# EAGLE design placa_motor_v5 (EAGLE 9.5.1)
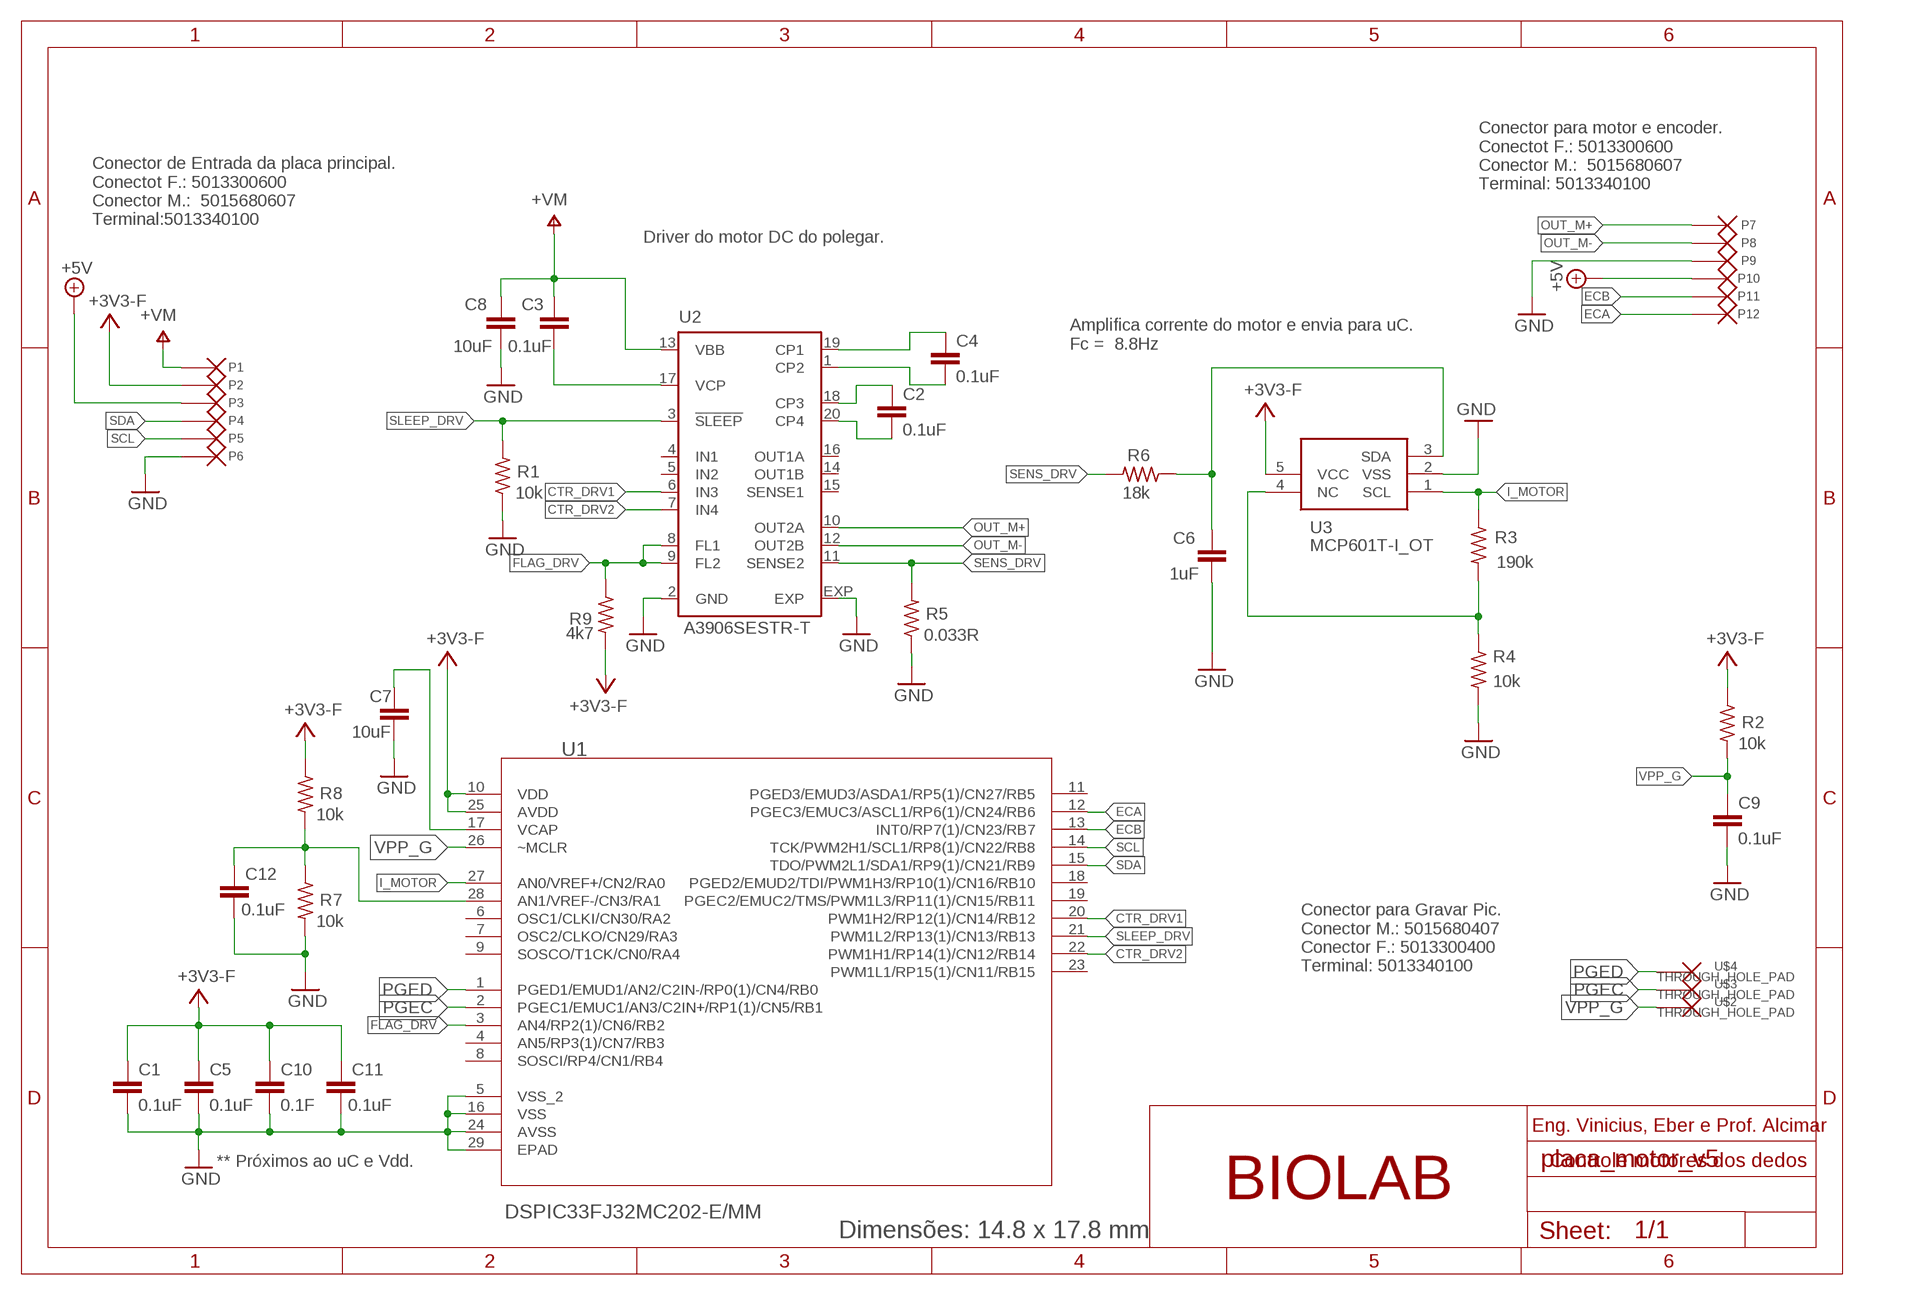
[diagram p0: schematic, sheet 1]

## Parts
C1  0.1uF  C-EUC0402K  [C0402K]
C2  0.1uF  C-EUC0402K  [C0402K]
C3  0.1uF  C-EUC0402K  [C0402K]
C4  0.1uF  C-EUC0402K  [C0402K]
C5  0.1uF  C-EUC0402K  [C0402K]
C6  1uF  C-EUC0402K  [C0402K]
C7  10uF  C-EUC0805K  [C0805K]
C8  10uF  C-EUC0805K  [C0805K]
C9  0.1uF  C-EUC0402K  [C0402K]
C10  0.1F  C-EUC0402K  [C0402K]
C11  0.1uF  C-EUC0402K  [C0402K]
C12  0.1uF  C-EUC0402K  [C0402K]
P1  THROUGH_HOLE_PAD  [THROUGH_HOLE_PAD]
P2  THROUGH_HOLE_PAD  [THROUGH_HOLE_PAD]
P3  THROUGH_HOLE_PAD  [THROUGH_HOLE_PAD]
P4  THROUGH_HOLE_PAD  [THROUGH_HOLE_PAD]
P5  THROUGH_HOLE_PAD  [THROUGH_HOLE_PAD]
P6  THROUGH_HOLE_PAD  [THROUGH_HOLE_PAD]
P7  THROUGH_HOLE_PAD  [THROUGH_HOLE_PAD]
P8  THROUGH_HOLE_PAD  [THROUGH_HOLE_PAD]
P9  THROUGH_HOLE_PAD  [THROUGH_HOLE_PAD]
P10  THROUGH_HOLE_PAD  [THROUGH_HOLE_PAD]
P11  THROUGH_HOLE_PAD  [THROUGH_HOLE_PAD]
P12  THROUGH_HOLE_PAD  [THROUGH_HOLE_PAD]
R1  10k  R-US_R0402  [R0402]
R2  10k  R-US_R0402  [R0402]
R3  190k  R-US_R0402  [R0402]
R4  10k  R-US_R0402  [R0402]
R5  0.033R  R-US_R0805  [R0805]
R6  18k  R-US_R0402  [R0402]
R7  10k  R-US_R0402  [R0402]
R8  10k  R-US_R0402  [R0402]
R9  4k7  R-US_R0402  [R0402]
U1  DSPIC33FJ32MC202-E/MM  [QFN65P600X600X100-29N]
U2  A3906SESTR-T  A3906  [QFN20]
U3  MCP601T-I_OT  [SOT95P270X145-5N]
U$2  THROUGH_HOLE_PAD  [THROUGH_HOLE_PAD]
U$3  THROUGH_HOLE_PAD  [THROUGH_HOLE_PAD]
U$4  THROUGH_HOLE_PAD  [THROUGH_HOLE_PAD]

## Nets
+3V3: C1.1 C5.1 C10.1 C11.1 P2.P$1(PIN) R2.1 R8.1 R9.2 U1.10(VDD) U1.25(AVDD) U3.5(VCC) ; supply symbol labelled +3V3-F
+5V: P3.P$1(PIN) P10.P$1(PIN)
AUX: C12.1 R7.1 R8.2 U1.28(AN1/VREF-/CN3/RA1)
CTR_DRV1: U1.20(PWM1H2/RP12(1)/CN14/RB12) U2.6(IN3)
CTR_DRV2: U1.22(PWM1H1/RP14(1)/CN12/RB14) U2.7(IN4)
ECA: P12.P$1(PIN) U1.12(PGEC3/EMUC3/ASCL1/RP6(1)/CN24/RB6)
ECB: P11.P$1(PIN) U1.13(INT0/RP7(1)/CN23/RB7)
FLAG_DRV: R9.1 U1.3(AN4/RP2(1)/CN6/RB2) U2.8(FL1) U2.9(FL2)
GND: C1.2 C5.2 C6.2 C7.2 C8.1 C9.2 C10.2 C11.2 C12.2 P6.P$1(PIN) P9.P$1(PIN) R1.1 R4.2 R5.1 R7.2 U1.5(VSS_2) U1.16(VSS) U1.24(AVSS) U1.29(EPAD) U2.2(GND) U2.EXP U3.2(VSS)
I_MOTOR: R3.1 U1.27(AN0/VREF+/CN2/RA0) U3.1(SCL)
N1: C7.1 U1.17(VCAP)
N2: R3.2 R4.1 U3.4(NC)
N3: C6.1 R6.1 U3.3(SDA)
N4: C4.1 U2.19(CP1)
N5: C4.2 U2.1(CP2)
N6: C2.1 U2.18(CP3)
N7: C2.2 U2.20(CP4)
N8: C3.2 U2.17(VCP)
OUT_M+: P7.P$1(PIN) U2.10(OUT2A)
OUT_M-: P8.P$1(PIN) U2.12(OUT2B)
PGEC: U1.2(PGEC1/EMUC1/AN3/C2IN+/RP1(1)/CN5/RB1) U$3.P$1(PIN)
PGED: U1.1(PGED1/EMUD1/AN2/C2IN-/RP0(1)/CN4/RB0) U$4.P$1(PIN)
SCL: P5.P$1(PIN) U1.14(TCK/PWM2H1/SCL1/RP8(1)/CN22/RB8)
SDA: P4.P$1(PIN) U1.15(TDO/PWM2L1/SDA1/RP9(1)/CN21/RB9)
SENS_DRV: R5.2 R6.2 U2.11(SENSE2)
SLEEP_DRV: R1.2 U1.21(PWM1L2/RP13(1)/CN13/RB13) U2.3(!SLEEP)
V+: C3.1 C8.2 P1.P$1(PIN) U2.13(VBB) ; supply symbol labelled +VM
VPP_G: C9.1 R2.2 U1.26(~MCLR) U$2.P$1(PIN)
Unconnected: U1.4(AN5/RP3(1)/CN7/RB3) U1.6(OSC1/CLKI/CN30/RA2) U1.7(OSC2/CLKO/CN29/RA3) U1.8(SOSCI/RP4/CN1/RB4) U1.9(SOSCO/T1CK/CN0/RA4) U1.11(PGED3/EMUD3/ASDA1/RP5(1)/CN27/RB5) U1.18(PGED2/EMUD2/TDI/PWM1H3/RP10(1)/CN16/RB10) U1.19(PGEC2/EMUC2/TMS/PWM1L3/RP11(1)/CN15/RB11) U1.23(PWM1L1/RP15(1)/CN11/RB15) U2.4(IN1) U2.5(IN2) U2.14(OUT1B) U2.15(SENSE1) U2.16(OUT1A)

## Notes on the sheet
- Conector para motor e encoder.
  Conectot F.: 5013300600
  Conector M.:  5015680607
  Terminal: 5013340100
- Conector de Entrada da placa principal.
  Conectot F.: 5013300600
  Conector M.:  5015680607
  Terminal:5013340100
- Driver do motor DC do polegar.
- Amplifica corrente do motor e envia para uC.
  Fc =  8.8Hz
- Conector para Gravar Pic.
  Conector M.: 5015680407
  Conector F.: 5013300400
  Terminal: 5013340100
- Eng. Vinicius, Eber e Prof. Alcimar
- ** Próximos ao uC e Vdd. | Controle motores dos dedos
- BIOLAB
- Dimensões: 14.8 x 17.8 mm

## Library data of the parts
C1-C12 = rcl:C-EU: CAPACITOR, European symbol
P1-P12 U$2-U$4 = THROUGH_HOLE_PAD:THROUGH_HOLE_PAD
R1-R9 = rcl:R-US_: RESISTOR, American symbol
U1 = DSPIC33FJ32MC202-E_MM:DSPIC33FJ32MC202-E/MM: 16-bit Digital Signal Controllers; DESCRIPTION: dsPIC Automotive, AEC-Q100, dsPIC™ 33F Microcontroller IC 16-Bit 40 MIPs 32KB _32K x 8_ FLASH 28-QFN-S _6x6_; DIGI-KEY_PART_NUMBER: DSPIC33FJ32MC202-E/MM-ND; DIGI-KEY_PURCHASE_URL: https://www.digikey.com/product-detail/en/microchip-technology/DSPIC33FJ32MC202-E-MM/DSPIC33FJ32MC202-E-MM-ND/1635835?utm_source=snapeda&utm_medium=aggregator&utm_campaign=symbol; MF: Microchip; MP: DSPIC33FJ32MC202-E/MM; PACKAGE: QFN-28 Microchip
U2 = allegro:A3906: Low Voltage Stepper and Single/Dual DC Motor Driver Data Sheet <http://www.allegromicro.com/en/Products/Part_Numbers/3906/3906.pdf>; SPICEPREFIX: X
U3 = MCP601T-I_OT:MCP601T-I_OT: 2.7 to 5.5V CMOS Operational Amplifier Source: Datasheet <http://ww1.microchip.com/downloads/en/DeviceDoc/21178H.pdf>; DESCRIPTION: 2.7 to 5.5V CMOS Operational Amplifier; HEIGHT: 1.45mm; MANUFACTURER_NAME: Microchip; MANUFACTURER_PART_NUMBER: MCP601T-I/OT; MOUSER_PART_NUMBER: 579-MCP601T-I/OT; MOUSER_PRICE-STOCK: https://www.mouser.co.uk/ProductDetail/Microchip-Technology/MCP601T-I-OT?qs=TQnwojwsYvgI5ywjvKCAVw%3D%3D

## Net classes
0 default: width 0.09 mm, drill 0.254 mm, clearance 0.05 mm
1 Power: width 0.15 mm, drill 0.254 mm, clearance 0.05 mm to class 0, clearance 0.05 mm

## Board
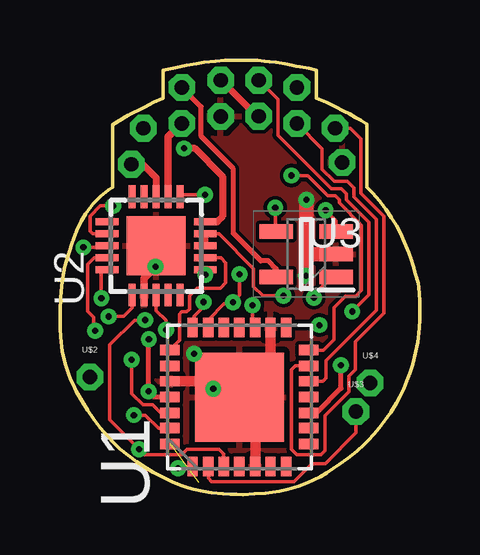
[diagram p1: board, top side]
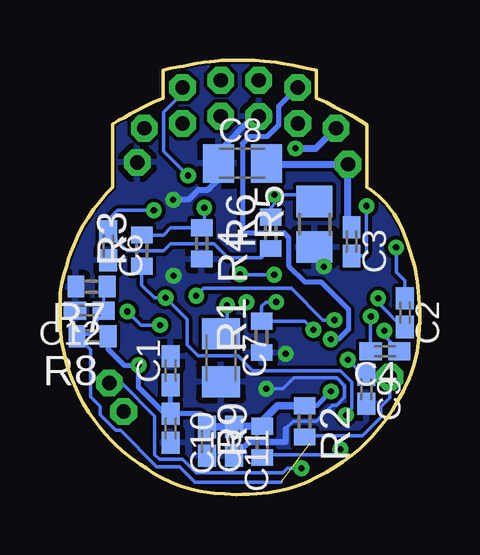
[diagram p2: board, bottom side, seen from below]

Size 15 x 18.11 mm. Coordinates in mm from the lower left corner, seen from the top.
Outline: 7.37,0 7.11,0.01 6.8,0.03 6.32,0.08 5.97,0.15 5.57,0.22 5.35,0.29 5.1,0.37 4.71,0.51 4.27,0.74 3.89,0.93 3.61,1.09 3.2,1.36 2.83,1.63 2.5,1.92 2.22,2.17 2,2.41 1.68,2.77 1.42,3.11 1.15,3.51 0.92,3.9 0.68,4.31 0.55,4.59 0.46,4.78 0.34,5.07 0.21,5.46 0.1,5.96 0.04,6.55 0.01,6.93 0,7.31 0,7.71 0.03,8.18 0.06,8.47 0.09,8.87 0.14,9.14 0.2,9.48 0.39,10.1 0.51,10.49 0.69,11 0.89,11.4 1.07,11.7 1.39,12.12 1.7,12.43 2.02,12.68 2.2,12.81 2.2,15.41 2.85,15.8 3.52,16.14 3.9,16.34 4.3,16.51 4.3,17.68 4.82,17.78 5.28,17.88 5.69,17.95 6,18.01 6.49,18.06 6.88,18.09 7.2,18.11 7.9,18.11 8.23,18.09 8.52,18.06 8.74,18.04 9,18.01 9.39,17.95 9.67,17.89 9.84,17.85 10.01,17.82 10.38,17.75 10.7,17.68 10.7,16.51 11.12,16.34 11.48,16.15 11.85,15.97 12.06,15.87 12.33,15.7 12.55,15.59 12.8,15.43 12.8,12.81 13.05,12.55 13.31,12.25 13.59,11.88 13.83,11.54 14.03,11.21 14.2,10.91 14.37,10.52 14.55,10.08 14.65,9.79 14.73,9.51 14.82,9.2 14.94,8.8 14.98,8.41 15,8.01 15,7.6 15,7.31 14.99,6.93 14.93,6.35 14.83,5.89 14.71,5.43 14.59,5.04 14.48,4.75 14.33,4.41 14.18,4.08 14.02,3.8 13.8,3.43 13.58,3.11 13.33,2.79 13.09,2.5 12.86,2.27 12.7,2.11 12.38,1.81 12.01,1.51 11.66,1.26 11.4,1.09 11.13,0.9 10.85,0.74 10.32,0.49 9.96,0.35 9.51,0.22 9.15,0.15 8.58,0.05 8.11,0.03 7.64,0 7.37,0
Copper layers (1*16): Top 0.035mm / dielectric 0.5mm / Bottom 0.035mm
Design rules "default *": minimum track width 6mil, minimum drill 6mil, track to track 6mil, track to pad 6mil, pad to pad 6mil, via to via 6mil, smd to smd 2mil, copper to edge 3mil, drill to drill 8mil, minimum pad ring 10mil, minimum via ring 8mil, stop-mask expansion 4mil, vias tented up to drill 0mil, thermal gap 10mil

### Footprints (pad centres in the part's own frame; a part is rotated, then mirrored left to right if it is on the bottom)
C0402K = smd 0.925 x 0.74: 1 -0.6,0; 2 0.6,0
C0805K = smd 1.3 x 1.6: 1 -1,0; 2 1,0
THROUGH_HOLE_PAD = drill 0.6 pad 1 octagon: P$1 0,0
R0402 = smd 0.7 x 0.9: 1 -0.65,0; 2 0.65,0
R0805 = smd 1.3 x 1.5: 1 -0.95,0; 2 0.95,0
QFN65P600X600X100-29N = smd 0.813 x 0.432: 1 -2.896,1.956; 2 -2.896,1.295; 3 -2.896,0.66; 4 -2.896,0; 5 -2.896,-0.66; 6 -2.896,-1.295; 7 -2.896,-1.956; 15 2.896,-1.956; 16 2.896,-1.295; 17 2.896,-0.66; 18 2.896,0; 19 2.896,0.66; 20 2.896,1.295; 21 2.896,1.956 | smd 0.432 x 0.813: 8 -1.956,-2.896; 9 -1.295,-2.896; 10 -0.66,-2.896; 11 0,-2.896; 12 0.66,-2.896; 13 1.295,-2.896; 14 1.956,-2.896; 22 1.956,2.896; 23 1.295,2.896; 24 0.66,2.896; 25 0,2.896; 26 -0.66,2.896; 27 -1.295,2.896; 28 -1.956,2.896 | smd 3.708 x 3.708: 29 0,0
QFN20 = smd 0.95 x 0.3: 1 -2.05,1; 2 -2.05,0.5; 3 -2.05,0; 4 -2.05,-0.5; 5 -2.05,-1; 11 2.05,-1; 12 2.05,-0.5; 13 2.05,0; 14 2.05,0.5; 15 2.05,1 | smd 0.3 x 0.95: 6 -1,-2.05; 7 -0.5,-2.05; 8 0,-2.05; 9 0.5,-2.05; 10 1,-2.05; 16 1,2.05; 17 0.5,2.05; 18 0,2.05; 19 -0.5,2.05; 20 -1,2.05 | smd 2.45 x 2.45: EXP 0,0
SOT95P270X145-5N = smd 1.4 x 0.6: 1 -1.25,0.95; 2 -1.25,0; 3 -1.25,-0.95; 4 1.25,-0.95; 5 1.25,0.95

### Placement (x,y rotation side)
C1  10.39,5.16 90 bottom
C2  0.61,7.58 270 bottom
C3  2.83,10.54 270 bottom
C4  1.44,5.97 180 bottom
C5  8.87,2.22 270 bottom
C6  12.99,10.36 270 bottom
C7  8.28,5.7 270 bottom
C8  7.39,13.8 0 bottom
C9  2.22,4.39 270 bottom
C10  10.39,2.76 270 bottom
C11  7.74,2.23 270 bottom
C12  13.78,7.66 180 bottom
P1  2.99,13.76 0 top
P2  5.09,16.96 0 top
P3  6.71,17.26 0 top
P4  8.29,17.26 0 bottom
P5  9.89,16.96 0 top
P6  6.7,15.75 0 top
P7  3.49,15.26 0 top
P8  5.08,15.46 0 top
P9  11.77,13.84 0 top
P10  8.29,15.76 0 top
P11  11.49,15.26 0 top
P12  9.89,15.46 0 top
R1  6.59,6.57 90 bottom
R2  4.8,3.05 270 bottom
R3  11.59,10.16 90 bottom
R4  9.09,10.46 270 bottom
R5  4.39,11.26 90 bottom
R6  6.21,10.9 90 bottom
R7  13.69,8.66 180 bottom
R8  13.65,6.6 180 bottom
R9  6.57,2.19 90 bottom
U1  7.49,4.06 90 top
U2  4.01,10.36 90 top
U3  10.27,10.02 180 top
U$2  1.24,4.9 0 top
U$3  12.35,3.45 0 top
U$4  12.94,4.65 0 top

### Tracks (layer width: path | path; a pad name or v marks a point on that pad's centre or on a via)
+3V3  (via drill 0.25)
  Top 0.2: v3.71,6.47 3.68,6.45 3.68,4.31 v3.7,4.3 3.93,4.06 U1.25
  Top 0.203: U3.5 9.02,9.42 8.7,9.74 8.38,9.74 7.24,10.88 7.24,13.57 5.89,14.92 5.89,16.16 P2.P$1 | U1.10 10.41,3.43 10.73,3.43 11.72,4.42 v11.72,5.39
  Bottom 0.2: 3.38,6.47 v3.71,6.47 | C5.1 8.87,3.12 9.12,3.36 | C10.1 C1.1
  Bottom 0.203: P2.P$1 5.89,16.16 5.89,15.38 6.36,14.91 7.1,14.91 7.39,14.62 7.39,10.92 5.65,10.92 5.47,10.73 5.47,9.54 4.79,8.86 4.11,8.86 2.96,7.71 2.96,6.89 3.38,6.47 | v3.7,4.3 4.29,3.7 R2.1 | 9.12,3.36 C10.1 10.62,3.36 11.72,4.47 v11.72,5.39 12.33,5.39 12.55,5.62 13,6.06 R8.1
  Bottom 0.305: R2.1 5.93,3.7 6.57,3.06 R9.2 7.72,2.84 C11.1 8.87,2.83 C5.1
+5V
  Top 0.3: P10.P$1 8.21,15.76 P3.P$1
AUX  (1 unrouted)
  Bottom 0.152: R7.1 13.18,8.66 C12.1 13.18,7.55 13.66,7.06 13.66,6.8 13.78,6.68 14.21,6.68 R8.2 13.72,6.03 13.72,4.07 13.32,3.67 13.32,3.32 12.67,2.67 12.48,2.67 10.98,1.17 10.02,1.17 9.36,0.51 5.79,0.51
CTR_DRV1  (via drill 0.25)
  Top 0.152: U1.20 6.19,7.29 6.85,7.95 7.2,7.95 7.22,7.96 v7.22,8.02 7.49,8.3 v7.49,9.17 | U2.6 v6.07,9.17 v6.06,9.16
  Bottom 0.152: v7.49,9.17 7.48,9.16 v6.06,9.16
CTR_DRV2
  Top 0.152: U1.22 4.64,6.08 4.99,6.43 4.99,7.52 5.08,7.61 5.29,7.61 5.4,7.72 5.4,8.28 5.72,8.6 6.69,8.6 6.91,8.82 6.91,9.66 6.71,9.86 U2.7
ECA
  Top 0.152: P12.P$1 10.94,14.41 10.94,13.56 11.45,13.05 11.98,13.05 12.26,12.78 12.26,12.42 13.2,11.48 13.2,7.68 11.09,5.58 11.09,4.85 10.96,4.72 U1.12
ECB
  Top 0.152: U1.13 9.83,5.36 9.66,5.19 9.66,1.89 9.89,1.66 10.88,1.66 11.05,1.82 11.05,3.28 12.05,4.29 12.05,4.93 12.33,5.2 12.33,6.37 13.51,7.55 13.51,11.6 12.56,12.55 12.56,14.83 12.12,15.26 P11.P$1
FLAG_DRV  (via drill 0.25)
  Top 0.152: U1.3 6.83,1.69 6.64,1.89 5.31,1.89 5.08,1.66 3.53,1.66 v3.3,1.89 2.08,3.11 2.08,6.23 3.12,7.27 v3.55,7.27 | v9.32,8.28 8.46,8.28 8.08,8.66 8.08,9.41 6.63,10.86 U2.9
  Top 0.254: U2.8 U2.9
  Bottom 0.152: R9.1 6.57,1.66 3.53,1.66 v3.3,1.89 | v9.32,8.28 9.01,8.59 5.35,8.59 4.03,7.27 v3.55,7.27
GND  (via drill 0.25)
  Top 0.152: v10.27,9.12 10.13,9.25
  Top 0.305: 7.55,4.06 U1.29 7.97,4.06 8.78,4.87 | v3.99,9.5 3.51,9.02 U2.2
  Top 0.43: U1.24 6.08,4.72 v6.4,4.4 7.15,4.4 U1.29 | U1.16 8.78,4.87
  Top 0.432: U1.5 8.15,3.47 7.55,4.06 | U1.29 7.39,4.06 v5.59,5.86
  Top 0.6: U3.2 10.27,10.02 v10.27,9.12 v10.27,12.29 v10.28,12.29
  Bottom 0.152: v6.4,4.4 5.7,4.4 5.24,4.86 3.45,4.86 3.13,4.53 3.13,4.06 3.46,3.73 3.64,3.73 4.31,3.06 5.27,3.06 5.6,2.74 | v3.99,9.5 3.99,9.92 R5.1
  Bottom 0.254: 5.6,2.74 5.6,2.19 7.13,2.19 7.69,1.63 C11.2 | P6.P$1 6.93,15.75 8.39,14.29 C8.1 8.39,13.14 8.83,12.7 9.22,12.7 9.63,12.29 v10.28,12.29
  pour Bottom: 2.22,12.94 0.99,11.68 0.2,9.6 0.03,8.24 -0.02,7.38 0.04,6.48 0.19,5.57 0.53,4.67 1.19,3.44 1.79,2.66 2.42,1.97 3.4,1.23 4.44,0.63 5.52,0.23 7.09,0.01 7.8,0 8.47,0.04 9.32,0.18 9.63,0.26 10.07,0.38 11.17,0.88 12.55,1.95 13.09,2.46 13.59,3.1 14.06,3.83 14.29,4.36 14.73,5.4 14.99,6.66 14.99,8.64 14.67,9.74 14.15,11.02 13.59,11.86 13.07,12.54 12.79,12.76 12.79,15.36 12.79,15.43 12.38,15.69 11.16,16.32 10.69,16.46 10.69,17.66 9.13,17.99 8.19,18.06 7.44,18.11 6.69,18.06 5.82,17.99 4.29,17.66 4.29,16.46 3.6,16.2 2.29,15.46 2.24,15.43
  pour Top: 2.2,15.4 2.23,13 0.99,11.57 0.31,10.01 0.02,8.18 0.04,6.93 0.18,5.54 0.62,4.47 1.34,3.19 2.35,2.03 3.86,0.95 5.01,0.39 6.56,0.04 7.83,-0.04 9.21,0.15 10.25,0.47 11.13,0.89 12.25,1.68 13.23,2.63 13.87,3.54 14.41,4.54 14.84,5.84 15.02,7.36 14.98,8.52 14.69,9.71 14.21,10.88 13.62,11.85 13.09,12.53 12.81,12.79 12.81,15.44 11.57,16.13 10.7,16.51 10.69,17.67 8.74,18.07 7.53,18.12 5.86,18.03 4.31,17.66 4.3,16.5 3.16,15.98 2.2,15.4
I_MOTOR  (via drill 0.25)
  Top 0.152: U1.27 4.1,2.77 3.56,3.31 v3.08,3.31 | U3.1 11.33,9.07 10.59,8.32 v10.59,8.2
  Bottom 0.152: v3.08,3.31 2.82,3.57 2.82,4.68 3.31,5.17 6.97,5.17 7.58,5.78 9.24,5.78 9.7,6.24 9.7,7.31 v10.59,8.2 11.06,8.2 11.59,8.73 R3.1
N1  (via drill 0.25)
  Top 0.152: U1.17 8.03,7.08 v8.03,7.89
  Bottom 0.152: v8.03,7.89 8.03,6.95 C7.1
N2  (via drill 0.25)
  Top 0.152: U3.4 8.98,10.97 v8.98,11.95
  Bottom 0.152: R3.2 10.69,10.81 10.39,11.11 R4.1 8.98,11.11 v8.98,11.95
N3  (via drill 0.25)
  Top 0.152: v11.09,11.84 11.52,11.4 U3.3
  Bottom 0.152: v11.09,11.84 12.59,11.84 12.86,11.57 12.86,11.09 C6.1 12.99,10.94 12.2,10.15 10.68,10.15 10.39,10.44 8.58,10.44 7.99,9.86 6.6,9.86 R6.1
N4  (via drill 0.25)
  Top 0.152: v1.47,6.82 1.41,6.89 1.41,7.4 1.16,7.64 1.16,9.59 1.43,9.86 U2.19
  Bottom 0.152: v1.47,6.82 1.47,6.61 1.12,6.26 1.12,5.97 C4.1
N5  (via drill 0.25)
  Top 0.152: v2.03,7.42 2.66,7.42 3.01,7.78 U2.1
  Bottom 0.152: v2.03,7.42 2.04,7.41 C4.2
N6  (via drill 0.25)
  Top 0.152: v0.98,10.3 1.96,10.3 U2.18
  Bottom 0.152: v0.98,10.3 v0.98,10.29 0.98,9.27 0.61,8.91 C2.1
N7  (via drill 0.25)
  Top 0.152: v1.73,8.19 1.73,9.37 U2.20
  Bottom 0.152: C2.2 0.72,6.98 1.73,7.99 v1.73,8.19
N8  (via drill 0.25)
  Top 0.152: v2.21,12.03 1.68,12.03 1.26,11.61 1.26,10.97 1.36,10.86 U2.17
  Bottom 0.152: C3.2 2.33,9.94 2.23,10.05 2.23,12.01 v2.21,12.03
OUT_M+  (via drill 0.25)
  Top 0.3: U2.10 6.56,11.36 6.78,11.58 6.78,13.27 5.63,14.42 v5.18,14.42
  Bottom 0.3: v5.18,14.42 4.33,14.42 P7.P$1
OUT_M-
  Top 0.305: U2.12 4.51,14.9 P8.P$1
PGEC
  Top 0.152: U$3.P$1 12.35,2.57 11.07,1.29 10.51,1.29 9.75,0.53 6.33,0.53 6.19,0.67 U1.2
PGED  (via drill 0.25)
  Top 0.152: U1.1 5.46,1.09 v4.93,1.09
  Bottom 0.152: v4.93,1.09 5.52,1.09 5.71,0.91 9.32,0.91 9.89,1.47 10.85,1.47 11.05,1.67 11.05,3.27 12.42,4.65 U$4.P$1
SCL  (via drill 0.25)
  Top 0.152: U1.14 10.98,6.02 11.42,6.46 11.42,7.77 11.92,8.27 12.34,8.27 12.58,8.5 12.58,11.23 11.65,12.16 11.65,12.29 11.5,12.44 11.18,12.44 10.33,13.29 v9.66,13.29
  Bottom 0.152: v9.66,13.29 10.68,14.31 10.68,15.93 9.89,16.73 P5.P$1
SDA  (via drill 0.25)
  Top 0.152: v10.83,7.06 9.55,7.06 U1.15 | v12.19,7.63 12.89,8.33 12.89,11.35 11.95,12.29 11.95,12.54 11.75,12.75 11.32,12.75 9.09,14.98 9.09,16.46 P4.P$1
  Bottom 0.152: v12.19,7.63 11.62,7.06 v10.83,7.06
SENS_DRV  (via drill 0.25)
  Top 0.152: U2.11 5.1,12.5 v6.06,12.5
  Bottom 0.152: R6.2 6.21,11.96 6.06,12.11 v6.06,12.5 4.9,12.5 4.61,12.21 R5.2
SLEEP_DRV  (via drill 0.25)
  Top 0.152: U2.3 4.01,7.67 4.43,7.25 v4.43,6.86 | v5.98,8.02 5.98,7.83 5.59,7.43 5.59,7.02 U1.21
  Bottom 0.152: v4.43,6.86 4.78,7.22 R1.2 6.59,7.84 6.41,8.02 v5.98,8.02
V+
  Top 0.3: P1.P$1 3.45,13.76 4.01,13.2 U2.13
  Bottom 0.3: C8.2 6.35,13.76 P1.P$1 2.99,11.3 C3.1
VPP_G  (via drill 0.25)
  Top 0.152: U1.26 4.2,3.4 3.87,3.74 3.46,3.74 2.99,4.21 v2.99,5.62
  Bottom 0.152: R2.2 4.68,2.4 4.63,2.45 2.4,2.45 1.62,3.23 1.62,3.65 1.24,4.03 U$2.P$1 2.26,4.9 v2.99,5.62
  Bottom 0.305: C9.1 2.22,4.9 U$2.P$1